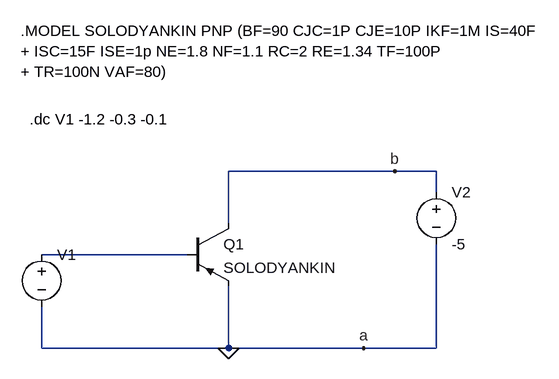
[diagram p0: schematic Draft1_1.asc]
Draft1_1.asc, the LTspice schematic file:
Version 4
SHEET 1 1708 680
WIRE 608 224 352 224
WIRE 672 224 608 224
WIRE 672 256 672 224
WIRE 352 304 352 224
WIRE 288 352 64 352
WIRE 64 496 64 432
WIRE 352 496 352 400
WIRE 352 496 64 496
WIRE 560 496 352 496
WIRE 672 496 672 336
WIRE 672 496 560 496
FLAG 352 496 0
FLAG 560 496 a
FLAG 608 224 b
SYMBOL pnp 288 304 R0
SYMATTR InstName Q1
SYMATTR Value SOLODYANKIN
SYMBOL voltage 64 336 R0
SYMATTR InstName V1
SYMATTR Value ""
SYMBOL voltage 672 240 R0
WINDOW 123 0 0 Left 2
WINDOW 39 0 0 Left 2
SYMATTR InstName V2
SYMATTR Value -5
TEXT 32 8 Left 2 !.MODEL SOLODYANKIN PNP (BF=90 CJC=1P CJE=10P IKF=1M IS=40F\n+ ISC=15F ISE=1p NE=1.8 NF=1.1 RC=2 RE=1.34 TF=100P\n+ TR=100N VAF=80)
TEXT 46 144 Left 2 !.dc V1 -1.2 -0.3 -0.1

The netlist it stands for:
* Draft1_1.asc
Q1 b N001 0 0 SOLODYANKIN
V1 N001 0
V2 b 0 -5
.model NPN NPN
.model PNP PNP
.lib standard.bjt
.MODEL SOLODYANKIN PNP (BF=90 CJC=1P CJE=10P IKF=1M IS=40F
+ ISC=15F ISE=1p NE=1.8 NF=1.1 RC=2 RE=1.34 TF=100P
+ TR=100N VAF=80)
.dc V1 -1.2 -0.3 -0.1
.backanno
.end